# Altium schematic sheet USB.SchDoc: USB-C connector
size 297 x 209 mm; Author: Dmitry Shpakov; Organization: NoName; Revision: Revision; SheetNumber: 11; SheetTotal: 12; PageSize: A4; ProjectName: Project Name
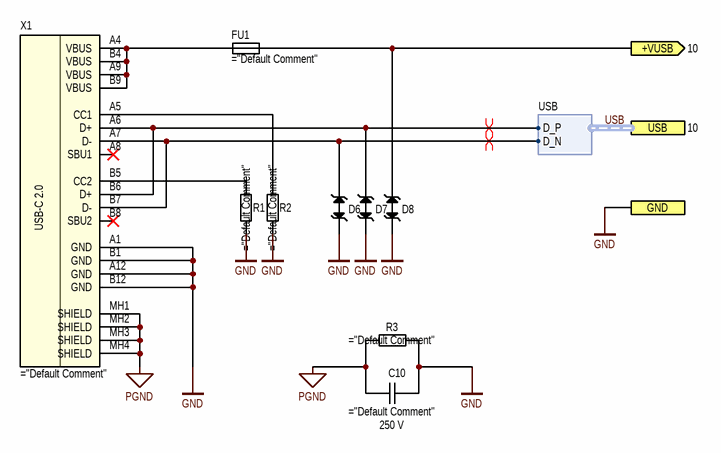
[diagram p0: USB.SchDoc]

## Parts
C10  Rated Voltage: 250 V
D6  (no value)
D7  (no value)
D8  (no value)
FU1  (no value)
R1  (no value)
R2  (no value)
R3  (no value)
X1  (no value)

## Ports
+VUSB (out, see 10), GND (see 10, 3, 4, 5, 6, 9, 10, 12), USB (harness USB, see 10)

## Harnesses
USB: D_P, D_N

## Nets
GND: C10.2 D6.2 D7.2 D8.2 R1.2 R2.2 R3.2 X1.A1(GND) X1.A12(GND) X1.B1(GND) X1.B12(GND) ; port GND
PGND: C10.1 R3.1 X1.MH1(SHIELD) X1.MH2(SHIELD) X1.MH3(SHIELD) X1.MH4(SHIELD)
+VUSB: D8.1 FU1.2 ; port +VUSB
USB.D_N: D6.1 X1.A7(D-) X1.B7(D-) ; port USB.D_N
USB.D_P: D7.1 X1.A6(D+) X1.B6(D+) ; port USB.D_P
NetFU1_1: FU1.1 X1.A4(VBUS) X1.A9(VBUS) X1.B4(VBUS) X1.B9(VBUS)
NetR1_1: R1.1 X1.B5(CC2)
NetR2_1: R2.1 X1.A5(CC1)

Not connected (* = marked no-connect by the designer): X1 A8(SBU1)* B8(SBU2)*

## Buses and harness runs
harness USB = port USB

## Layout directives
differential pair: USB.D_N, USB.D_P

## Notes on the sheet
- Author
- Date
- Organization
- Page
- Total pages
- Materials
- Page size
- (in symbol USB4085-GF-A) USB-C 2.0

## Library data of the parts
C10 = CC0805KRX7RYBB472: CAP CER 4700PF 250V X7R 0805; Manufacturer: YAGEO; Type: capacitor; Power Dissipation: * W; Rated Current: * A; Tolerance: 10 %; Other: 4700 pF ±10% 250V Ceramic Capacitor X7R 0805 (2012 Metric); Operating Temperature: -55 °C to +125 °C; HelpURL: https://www.digikey.com/en/products/detail/yageo/CC0805KRX7RYBB472/5884263; Default Comment: 4700 pF; Rated Power: * W; Value: 4700 pF; Summary: ="Type"+" "+"Part Number"+" "+"Manufacturer"+" "+"Value"+" "+"Tolerance"+" "+"Operating Temperature"+" "+"Case"+" "+"Power Dissipation"+" "+"Rated Current"+" "+"Rated Power"+" "+"Rated Voltage"+" "+"Other"; Assembly: *; Case: 0805; Part Number: CC0805KRX7RYBB472
D6-D8 = UAD8C05L01: TVS DIODE 5VWM 20VC SOD882; Manufacturer: YAGEO; Power Dissipation: * W; Rated Voltage: 20 V; Rated Current: * A; Tolerance: * %; Other: 20V (Typ) Clamp 3A (8/20µs) Ipp Tvs Diode Surface Mount SOD-882; Operating Temperature: -50 °C to +150 °C; Type: diode; HelpURL: https://www.digikey.com/en/products/detail/yageo/UAD8C05L01/13689529; Default Comment: UAD8C05L01; Rated Power: * W; Value: *; Summary: ="Type"+" "+"Part Number"+" "+"Manufacturer"+" "+"Value"+" "+"Tolerance"+" "+"Operating Temperature"+" "+"Case"+" "+"Power Dissipation"+" "+"Rated Current"+" "+"Rated Power"+" "+"Rated Voltage"+" "+"Other"; Assembly: *; Case: SOD-882; Part Number: UAD8C05L01
FU1 = 04000025WR: FUSE 500MA 5V FAST 0603 SMD; Manufacturer: Littelfuse Inc.; Power Dissipation: * W; Tolerance: * %; Other: 500 mA AC 5 V DC Fuse Board Mount (Cartridge Style Excluded) Surface Mount 0603 (1608 Metric); Operating Temperature: -55 °C to +150 °C; Type: fuse; HelpURL: https://www.digikey.com/en/products/detail/littelfuse-inc/04000025WR/10271162?s=N4IgjCBcoGwJxVAYygMwIYBsDOBTANCAPZQDaIALAAxwDMdIAuoQA4AuUIAymwE4CWAOwDmIAL6EATFQAcMxCBSQMOAsTIgArFSoACALYBBJqw6QQAVUH82AeVQBZXOmwBXXrnFSwFCgqUqeIQkkOSaugBqJiDsnFY29k4u7p4SIAC0kv5QfK5qIWFMYmlZoSCornhFQA; Default Comment: 500 mA; Rated Voltage: 5 V; Rated Current: 500 mA; Rated Power: * W; Value: *; Summary: ="Type"+" "+"Part Number"+" "+"Manufacturer"+" "+"Value"+" "+"Tolerance"+" "+"Operating Temperature"+" "+"Case"+" "+"Power Dissipation"+" "+"Rated Current"+" "+"Rated Power"+" "+"Rated Voltage"+" "+"Other"; Assembly: *; Case: 0603; Part Number: 04000025WR
R1 R2 = RC0603FR-075K1L: RES 5.1K OHM 1% 1/10W 0603; Manufacturer: YAGEO; Default Comment: 5k1; Rated Voltage: * V; Rated Current: * A; Value: 5k1; Other: 5.1 kOhms ±1% 0.1W, 1/10W Chip Resistor 0603 (1608 Metric) Moisture Resistant Thick Film; Operating Temperature: -55 °C to +155 °C; Type: resistor; HelpURL: https://www.digikey.com/en/products/detail/yageo/RC0603FR-075K1L/727268; Power Dissipation: 1/10 W; Rated Power: 1/10 W; Tolerance: 1 %; Summary: ="Type"+" "+"Part Number"+" "+"Manufacturer"+" "+"Value"+" "+"Tolerance"+" "+"Operating Temperature"+" "+"Case"+" "+"Power Dissipation"+" "+"Rated Current"+" "+"Rated Power"+" "+"Rated Voltage"+" "+"Other"; Assembly: *; Case: 0603; Part Number: RC0603FR-075K1L
R3 = RC0603FR-071ML: RES 1M OHM 1% 1/10W 0603; Manufacturer: YAGEO; Power Dissipation: 0.1 W; Rated Voltage: * V; Rated Current: * A; Other: 1 MOhms ±1% 0.1W, 1/10W Chip Resistor 0603 (1608 Metric) Moisture Resistant Thick Film; Operating Temperature: -55 °C to +155 °C; Type: resistor; HelpURL: https://www.digikey.com/en/products/detail/yageo/RC0603FR-071ML/726844; Default Comment: 1M; Rated Power: 0.1 W; Tolerance: 1 %; Value: 1M; Summary: ="Type"+" "+"Part Number"+" "+"Manufacturer"+" "+"Value"+" "+"Tolerance"+" "+"Operating Temperature"+" "+"Case"+" "+"Power Dissipation"+" "+"Rated Current"+" "+"Rated Power"+" "+"Rated Voltage"+" "+"Other"; Assembly: *; Case: 0603; Part Number: RC0603FR-071ML
X1 = USB4085-GF-A: CONN RCPT USB2.0 TYPE C 16+8POS; Manufacturer: GCT; Power Dissipation: * W; Rated Voltage: * V; Rated Current: * A; Tolerance: * %; Other: USB-C (USB TYPE-C) USB 2.0 Receptacle Connector 24 (16+8 Dummy) Position Through Hole, Right Angle; Operating Temperature: -40 °C to +85 °C; Type: connector; HelpURL: https://www.digikey.com/en/products/detail/gct/USB4085-GF-A/9859662; Default Comment: USB4085-GF-A; Rated Power: * W; Value: *; Summary: ="Type"+" "+"Part Number"+" "+"Manufacturer"+" "+"Value"+" "+"Tolerance"+" "+"Operating Temperature"+" "+"Case"+" "+"Power Dissipation"+" "+"Rated Current"+" "+"Rated Power"+" "+"Rated Voltage"+" "+"Other"; Assembly: *; Case: USB-C (USB TYPE-C) Through Hole, Right Angle; Part Number: USB4085-GF-A